# EasyEDA schematic SCHEMATIC.json
TITLE: Sheet_1; REV: 1.0; Date: 2024-08-02; Sheet: 1/1; Drawn By: mats.rohtmets; Company: Your Company
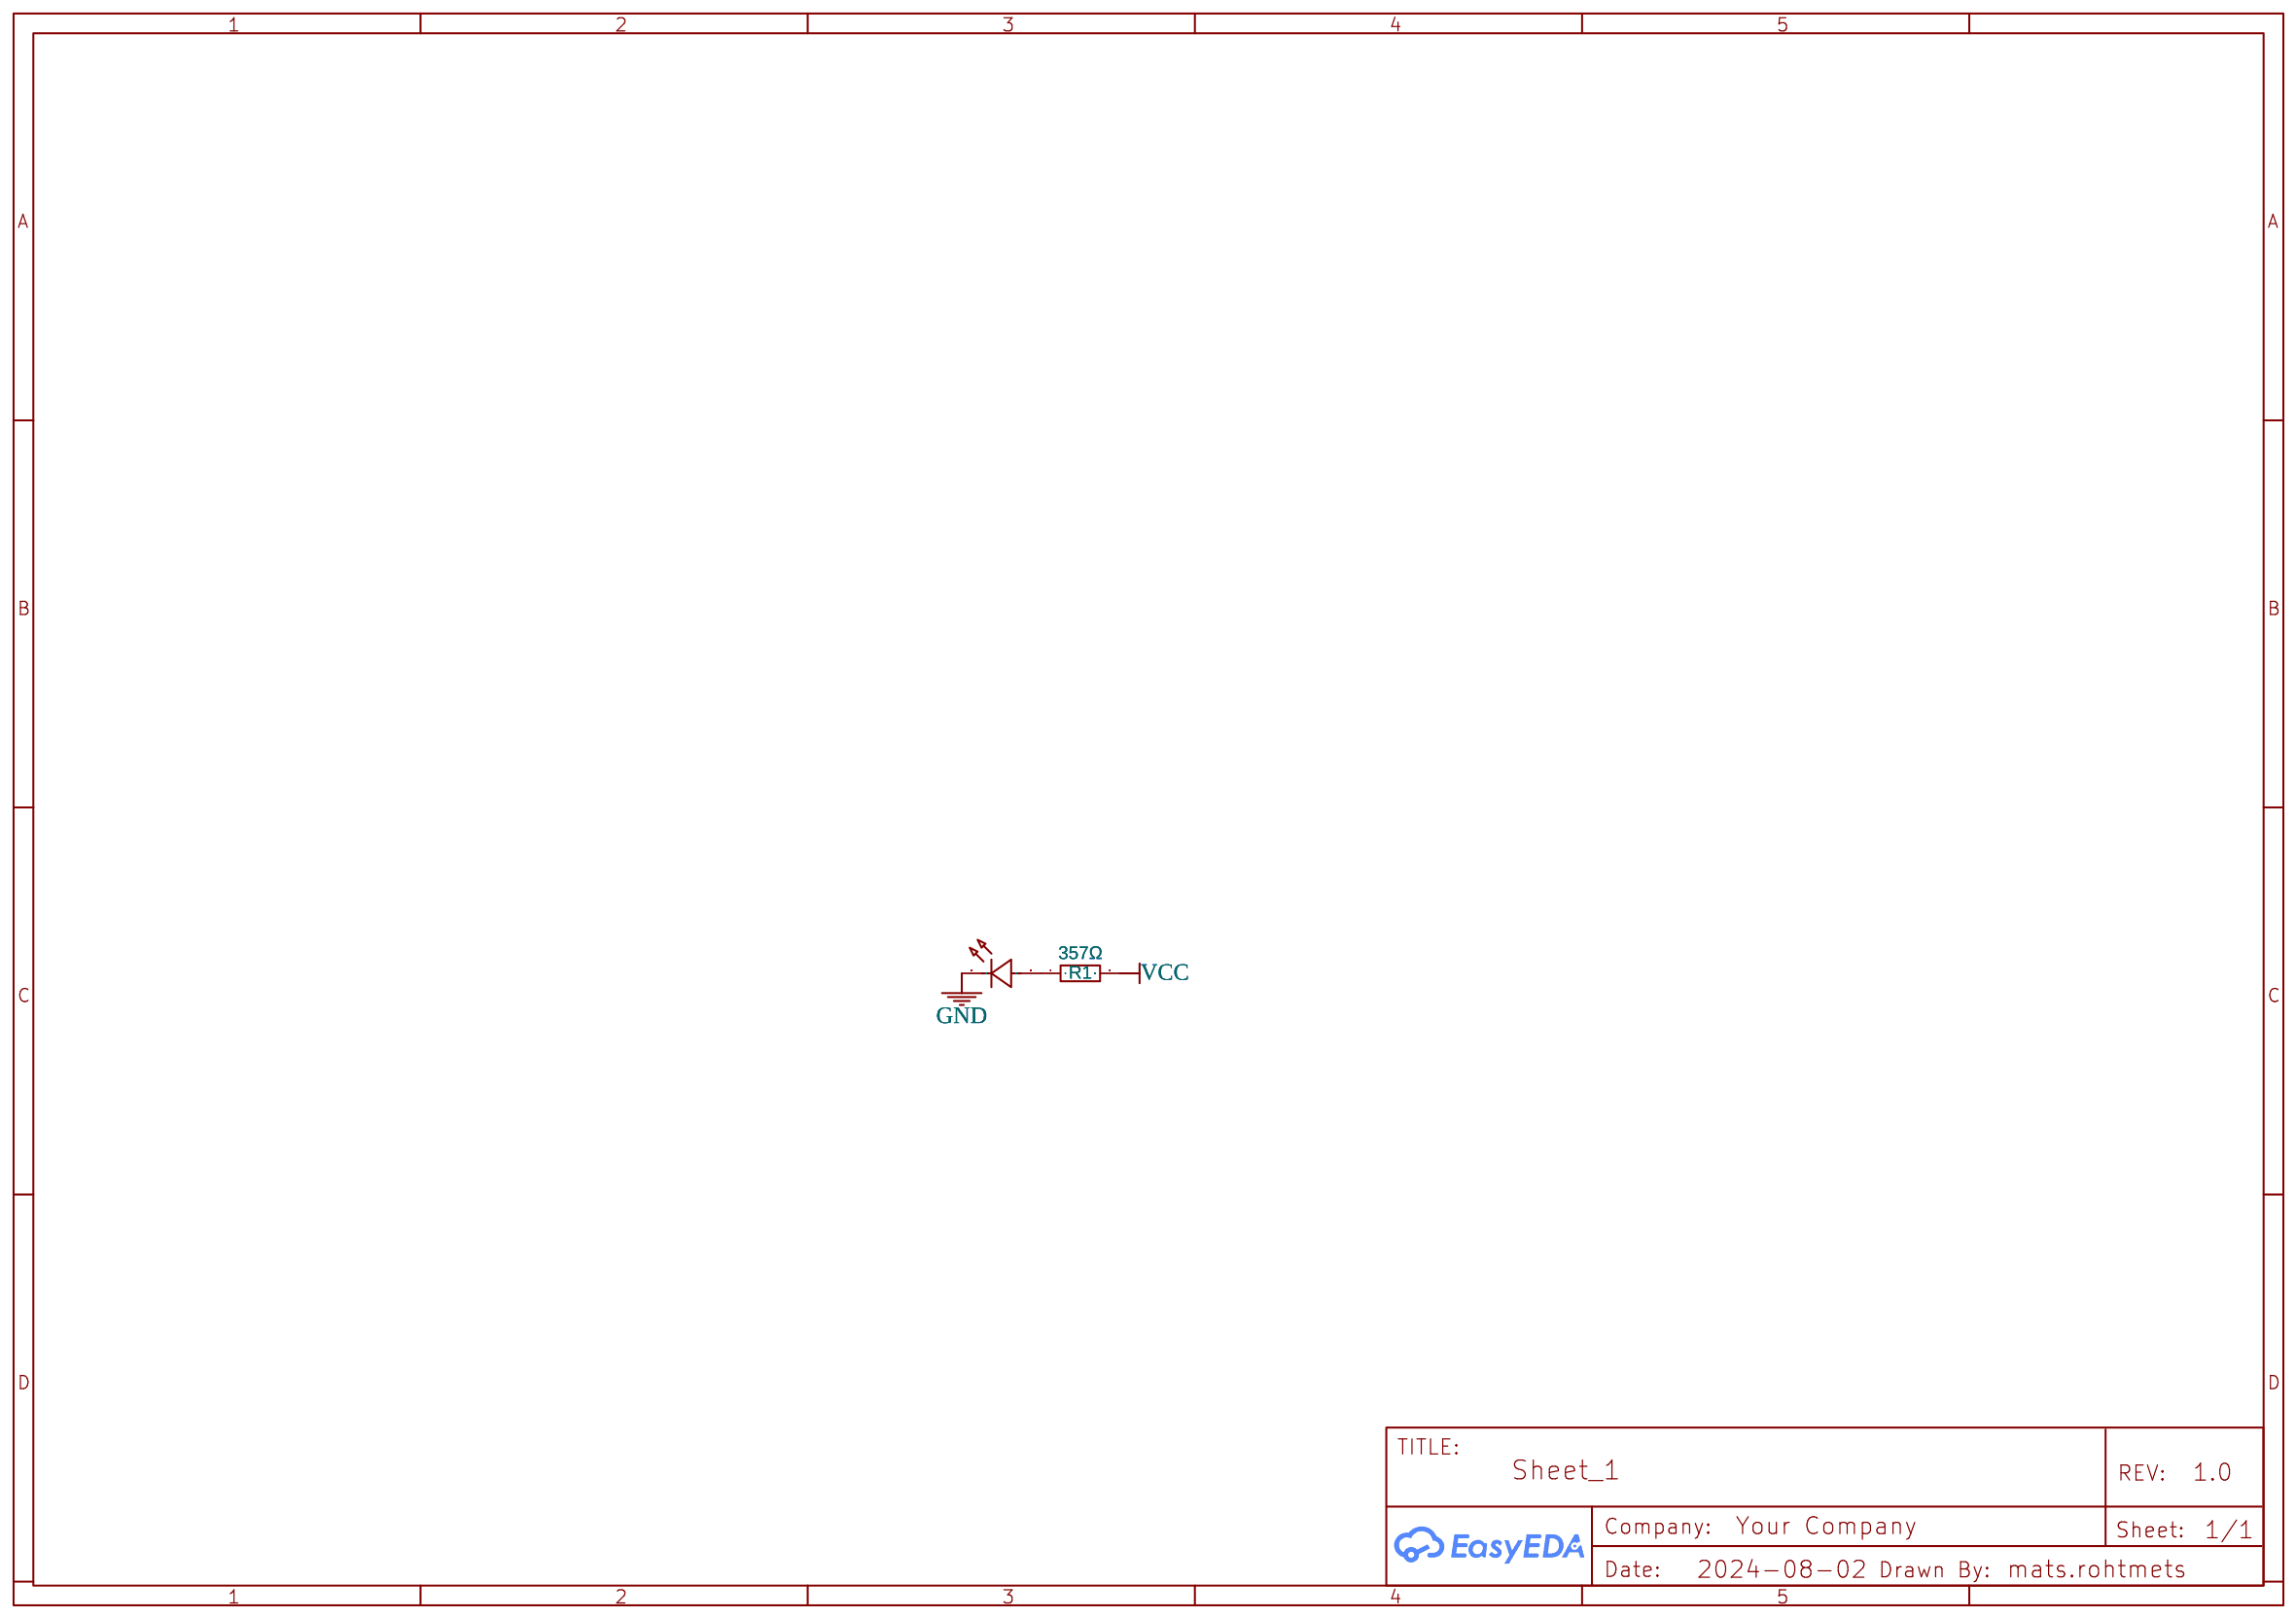
[diagram p0: schematic sheet]

## Parts
L1  XL-3216UYC_C965824  [LED1206-RD_RED]
R1  357Ω  [R0805]

## Library data of the parts
L1 = XL-3216UYC_C965824: Supplier: LCSC; Supplier Part: C965824; Manufacturer: XINGLIGHT(成兴光); Manufacturer Part: XL-3216UYC; JLCPCB Part Class: Extended Part; Contributor: lcsc
R1 = ARG05FTC3570: Contributor: LCSC; Supplier: LCSC; Supplier Part: C218527; Manufacturer: Viking(光颉); JLCPCB Part Class: Extended Part

## Nets
GND: L1.1(K)
VCC: R1.2
Net-(L1-2): L1.2(A) R1.1
